# Altium schematic sheet GameBoard.SchDoc: Game Board for MiCore
size A4; DrawnBy: eleqian; Revision: 1.0; SheetNumber: 1; SheetTotal: 1
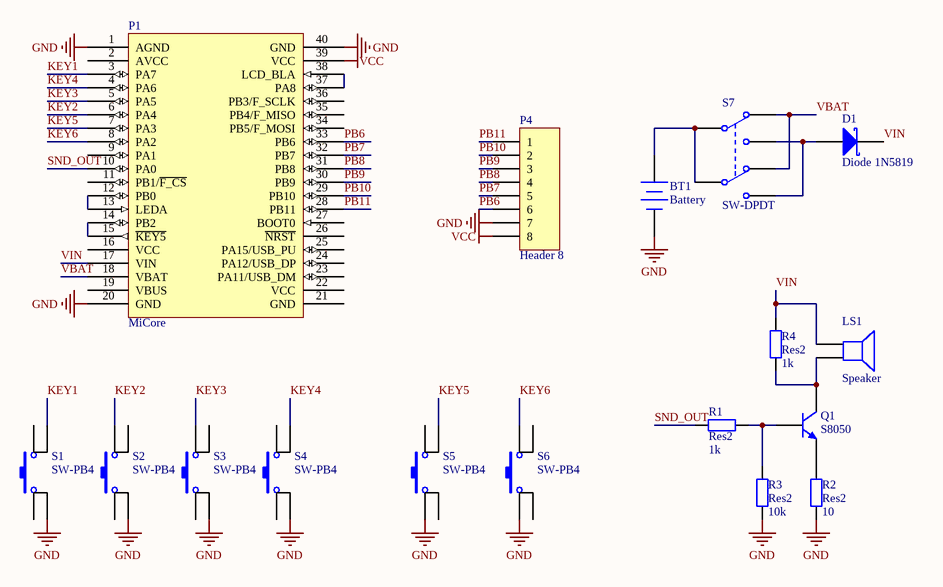
[diagram p0: GameBoard.SchDoc]

## Parts
BT1  Battery  [BAT-2]
D1  Diode 1N5819  [DO-204AL]
LS1  Speaker  [PIN2]
P1  MiCore  [MICORE]
P4  Header 8  [HDR1X8]
Q1  S8050  [TO-92]
R1  Res2  value 1k  [AXIAL-0.4]
R2  Res2  value 10  [AXIAL-0.4]
R3  Res2  value 10k  [AXIAL-0.4]
R4  Res2  value 1k  [AXIAL-0.4]
S1  SW-PB4  [SW-PB-4P]
S2  SW-PB4  [SW-PB-4P]
S3  SW-PB4  [SW-PB-4P]
S4  SW-PB4  [SW-PB-4P]
S5  SW-PB4  [SW-PB-4P]
S6  SW-PB4  [SW-PB-4P]
S7  SW-DPDT  [DPDT-6P]

## Nets
GND: BT1.2(-) P1.1(AGND) P1.20(GND) P1.40(GND) P4.7 R2.1 R3.1 S1.4 S2.4 S3.4 S4.4 S5.1 S6.1
VCC: P1.39(VCC) P4.8
KEY1: P1.3(PA7) S1.3
KEY2: P1.6(PA4) S2.2
KEY3: P1.5(PA5) S3.2
KEY4: P1.4(PA6) S4.3
KEY5: P1.7(PA3) S5.3
KEY6: P1.8(PA2) S6.2
PB6: P1.33(PB6) P4.6
PB7: P1.32(PB7) P4.5
PB8: P1.31(PB8) P4.4
PB9: P1.30(PB9) P4.3
PB10: P1.29(PB10) P4.2
PB11: P1.28(PB11) P4.1
SND_OUT: P1.10(PA0) R1.1
VBAT: P1.18(VBAT) S7.1(NC1) S7.6(NC2)
VIN: D1.2(K) LS1.1 P1.17(VIN) R4.2
NetBT1_1: BT1.1(+) S7.2(COMMON1) S7.5(COMMON2)
NetD1_1: D1.1(A) S7.3(NO1) S7.4(NO2)
NetLS1_2: LS1.2 Q1.1(C) R4.1
NetP1_12: P1.12(PB0) P1.13(LEDA)
NetP1_14: P1.14(PB2) P1.15(~{KEY5})
NetP1_37: P1.37(PA8) P1.38(LCD_BLA)
NetQ1_2: Q1.2(B) R1.2 R3.2
NetQ1_3: Q1.3(E) R2.2

Not connected (* = marked no-connect by the designer): P1 2(AVCC) 9(PA1) 11(PB1/~{F_CS}) 16(VCC) 19(VBUS) 21(GND) 22(VCC) 23(PA11/USB_DM) 24(PA12/USB_DP) 25(PA15/USB_PU) 26(~{NRST}) 27(BOOT0) 34(PB5/F_MOSI) 35(PB4/F_MISO) 36(PB3/F_SCLK); S1 1 2; S2 1 3; S3 1 3; S4 1 2; S5 2 4; S6 3 4

## Library data of the parts
BT1 = Battery: Multicell Battery; Published: 24-Mar-1999; LatestRevisionDate: 17-Jul-2002; LatestRevisionNote: Re-released for DXP Platform.; PackageReference: BAT-2; Publisher: Altium Limited; PackageDescription: Battery; 2 Leads
D1 = Diode 11DQ03: Schottky Rectifier; Published: 8-Jun-2000; LatestRevisionDate: 17-Jul-2002; LatestRevisionNote: Re-released for DXP Platform.; DatasheetVersion: Dec-1997; PackageReference: DO-204AL; Publisher: Altium Limited; PackageDescription: Diode, Axial; Body 5.2 x 2.7 mm (LxDia. max), Lead Dia. 0.86 mm (max); Code_JEDEC: DO-204-AL; ComponentLink1Description: Manufacturer Link; ComponentLink1URL: http://www.irf.com/; ComponentLink2Description: Datasheet; ComponentLink2URL: http://www.irf.com/product-info/datasheets/data/11dq03.pdf
LS1 = Speaker: Loudspeaker; Published: 24-Mar-1999; LatestRevisionDate: 17-Jul-2002; LatestRevisionNote: Re-released for DXP Platform.; PackageReference: PIN2; Publisher: Altium Limited
P1 = Mi: MiCore核心板
P4 = Header 8: Header, 8-Pin; LatestRevisionDate: 17-Jul-2002; LatestRevisionNote: Re-released for DXP Platform.; Publisher: Altium Limited
Q1 = NPN: NPN Bipolar Transistor; Published: 8-Jun-2000; LatestRevisionDate: 17-Jul-2002; LatestRevisionNote: Re-released for DXP Platform.; PackageReference: TO-226-AA; Publisher: Altium Limited; PackageDescription: TO, Flat Index; 3 In-Line, Axial Leads; Body Dia. 4.8mm; Leads 0.55 x 0.51 mm (max); Code_JEDEC: TO-226-AA
R1-R4 = Res2: Resistor; Published: 8-Jun-2000; LatestRevisionDate: 17-Jul-2002; LatestRevisionNote: Re-released for DXP Platform.; PackageReference: AXIAL-0.4; Publisher: Altium Limited; PackageDescription: Axial Device, Thru-Hole; 2 Leads; 0.4 in Pin Spacing
S1-S6 = SW-PB4: 普通4脚按键
S7 = SW-DPDT: 双刀双掷开关; Published: 24-Mar-1999; LatestRevisionDate: 29-May-2009; LatestRevisionNote: IPC-7351 Footprint Added.; PackageVersion: Mar-2001; PackageReference: SOT23-6; Publisher: Altium Limited; PackageDescription: 6-Pin SOT-23 Package 0.95 mm Pitch, 2.7 mm Lead Span; Code_JEITA: SC-74; Code_IPC: SOT26A-6